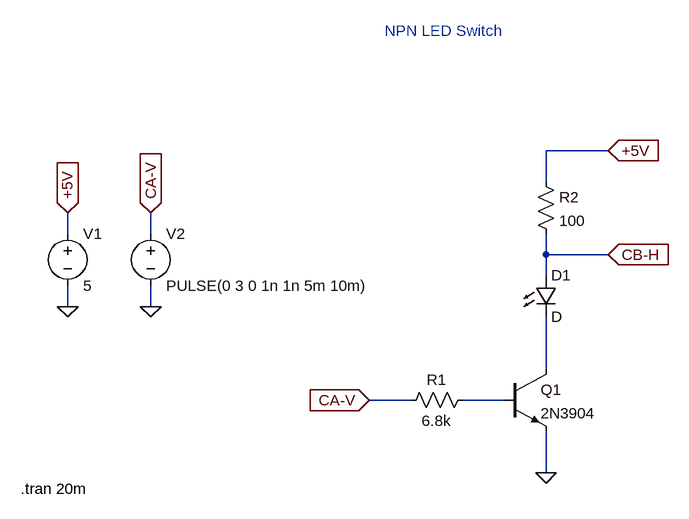
[diagram p0: schematic npn_led_switch_ltpice.asc]
npn_led_switch_ltpice.asc, the LTspice schematic file:
Version 4
SHEET 1 880 680
WIRE 368 -224 272 -224
WIRE 272 -176 272 -224
WIRE -464 -96 -464 -128
WIRE -336 -96 -336 -128
WIRE 272 -64 272 -96
WIRE 368 -64 272 -64
WIRE 272 -32 272 -64
WIRE -464 16 -464 -16
WIRE -336 16 -336 -16
WIRE 272 112 272 32
WIRE 64 160 0 160
WIRE 208 160 144 160
WIRE 272 272 272 208
FLAG 272 272 0
FLAG 368 -224 +5V
IOPIN 368 -224 In
FLAG 368 -64 CB-H
IOPIN 368 -64 In
FLAG 0 160 CA-V
IOPIN 0 160 In
FLAG -464 16 0
FLAG -336 16 0
FLAG -464 -128 +5V
IOPIN -464 -128 In
FLAG -336 -128 CA-V
IOPIN -336 -128 In
SYMBOL res 160 144 R90
WINDOW 0 0 56 VBottom 2
WINDOW 3 32 56 VTop 2
SYMATTR InstName R1
SYMATTR Value 6.8k
SYMBOL npn 208 112 R0
SYMATTR InstName Q1
SYMATTR Value 2N3904
SYMBOL LED 256 -32 R0
SYMATTR InstName D1
SYMBOL res 256 -192 R0
SYMATTR InstName R2
SYMATTR Value 100
SYMBOL voltage -464 -112 R0
WINDOW 123 0 0 Left 0
WINDOW 39 0 0 Left 0
SYMATTR InstName V1
SYMATTR Value 5
SYMBOL voltage -336 -112 R0
WINDOW 123 0 0 Left 0
WINDOW 39 0 0 Left 0
SYMATTR InstName V2
SYMATTR Value PULSE(0 3 0 1n 1n 5m 10m)
TEXT -536 296 Left 2 !.tran 20m
TEXT 24 -408 Left 2 ;NPN LED Switch

The netlist it stands for:
* npn_led_switch_ltpice.asc
R1 N002 CA-V 6.8k
Q1 N001 N002 0 0 2N3904
D1 CB-H N001 D
R2 +5V CB-H 100
V1 +5V 0 5
V2 CA-V 0 PULSE(0 3 0 1n 1n 5m 10m)
.model D D
.lib standard.dio
.model NPN NPN
.model PNP PNP
.lib standard.bjt
.tran 20m
* NPN LED Switch
.backanno
.end